# Altium schematic sheet OSCILLAR_HFB_V1p0_LFLNAMP.SchDoc
size A4; SheetNumber: 6; SheetTotal: 12; Title_: Low Freq. Low Noise Amp.
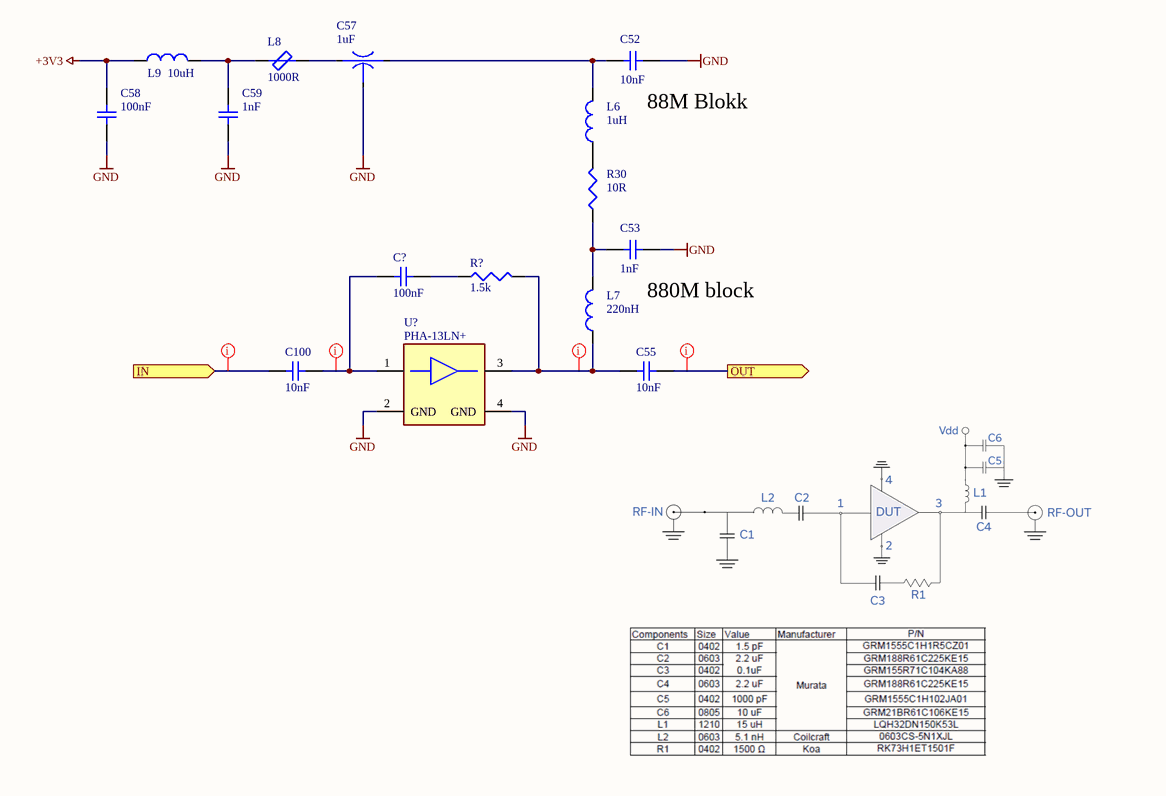
[diagram p0: OSCILLAR_HFB_V1p0_LFLNAMP.SchDoc]

## Parts
C52  10nF  [CAP-0805]
C53  1nF  [CAP-0805]
C55  10nF  [CAP_0603]
C57  1uF  [CAP-0805-EMI]
C58  100nF  [CAP-0805]
C59  1nF  [CAP-0805]
C100  10nF  [CAP_0603]
C?  100nF  [CAP_0603]
L6  1uH  [IND-0805]
L7  220nH  [IND-0805]
L8  1000R  [IND-0805-EMI]
L9  10uH  [IND-0805-EMI]
R30  10R  [RES-0805]
R?  1.5k  [RES-0603]
U?  PHA-13LN+  [DF782]

## Ports
IN (in, see OSCILLAR_HFB_V1p0_MAIN), OUT (out, see OSCILLAR_HFB_V1p0_MAIN)

## Nets
+3V3: C58.1 L9.1
GND: C52.2 C53.2 C57.2 C58.2 C59.2 U?.2(GND) U?.4(GND)
IN: C100.2 ; port IN
OUT: C55.1 ; port OUT
NetC52_1: C52.1 C57.1 L6.2
NetC53_1: C53.1 L7.2 R30.1
NetC55_2: C55.2 L7.1 R?.2 U?.3(RF_OUT)
NetC57_3: C57.3 L8.2
NetC59_1: C59.1 L8.1 L9.2
NetC100_1: C100.1 C?.2 U?.1(RF_IN)
NetC?_1: C?.1 R?.1
NetL6_1: L6.1 R30.2

## Layout directives
net class 50R: IN, NetC55_2, NetC100_1, OUT

## Notes on the sheet
- (near C52) 88M Blokk
- (near C53) 880M block
- Board:
- Author:
- Title:
- Project:
- SVN:
- Version:
- Sheet:
- of
- Contact:
- Modified:
- Size:
- A4

## Library data of the parts
C52 C53 C55 C58 C59 C100 C? = NP-CAPACITOR: MLCC capacitor; Type: CAP
C57 = EMI_CAPACITOR: EMI filter capacitor; Type: CAP
L6 L7 L9 = AC-INDUCTOR: Air core coil; Type: IND
L8 = BLM21SP102SN1D: Chip Ferrite Bead, 1000R @100MHz, 1.6A; Part number: 81-BLM21SP102SN1D; Type: IND; Supplier: Mouser; ComponentLink1Description: Datasheet; ComponentLink1URL: ENFA0005-1915781.pdf; ComponentLink2Description: Order; ComponentLink2URL: https://hu.mouser.com/ProductDetail/Murata-Electronics/BLM21SP102SN1D?qs=17u8i%2FzlE88oj6hmj%252BXptA%3D%3D
R30 R? = RESISTOR: Metal Film Resistor; Type: RES
U? = PHA-13LN+: RF Amplifier, Low noise, 1M-1GHz, +5V, +23dB; Part number: 139-PHA-13LN; ComponentLink1Description: Datasheet; Supplier: Mouser; ComponentLink2Description: Order; ComponentLink2URL: https://hu.mouser.com/ProductDetail/Mini-Circuits/PHA-13LN%2b?qs=xZ%2FP%252Ba9zWqYkwnUBoTp7PQ%3D%3D; Type: IC